# Altium schematic sheet io_connectors.SchDoc
size Letter; CompanyName: Carnegie Mellon University; Organization: Carnegie Mellon University; Address1: Carnegie Mellon University; Address2: Robotics Institute; Address3: 5000 Forbes Ave., 4208 NSH; Address4: Pittsburgh, PA 15213; DocumentNumber: 8; Revision: 1.0; SheetNumber: 8; SheetTotal: 8; PageSetup: Record=PageOptions|CenterHorizontal=True|CenterVertical=True|PrintScale=1.00|XCorrection=1.00|YCorrection=1.00|PrintKind=0|BorderSize=5000000|LeftOffset=0|BottomOffset=0|Orientation=2|PaperLength=1000|PaperWidth=1000|Scale=100|PaperSource=7|PrintQuality=-4|MediaType=1|DitherType=10|PaperKind=Letter|PrintScaleMode=1
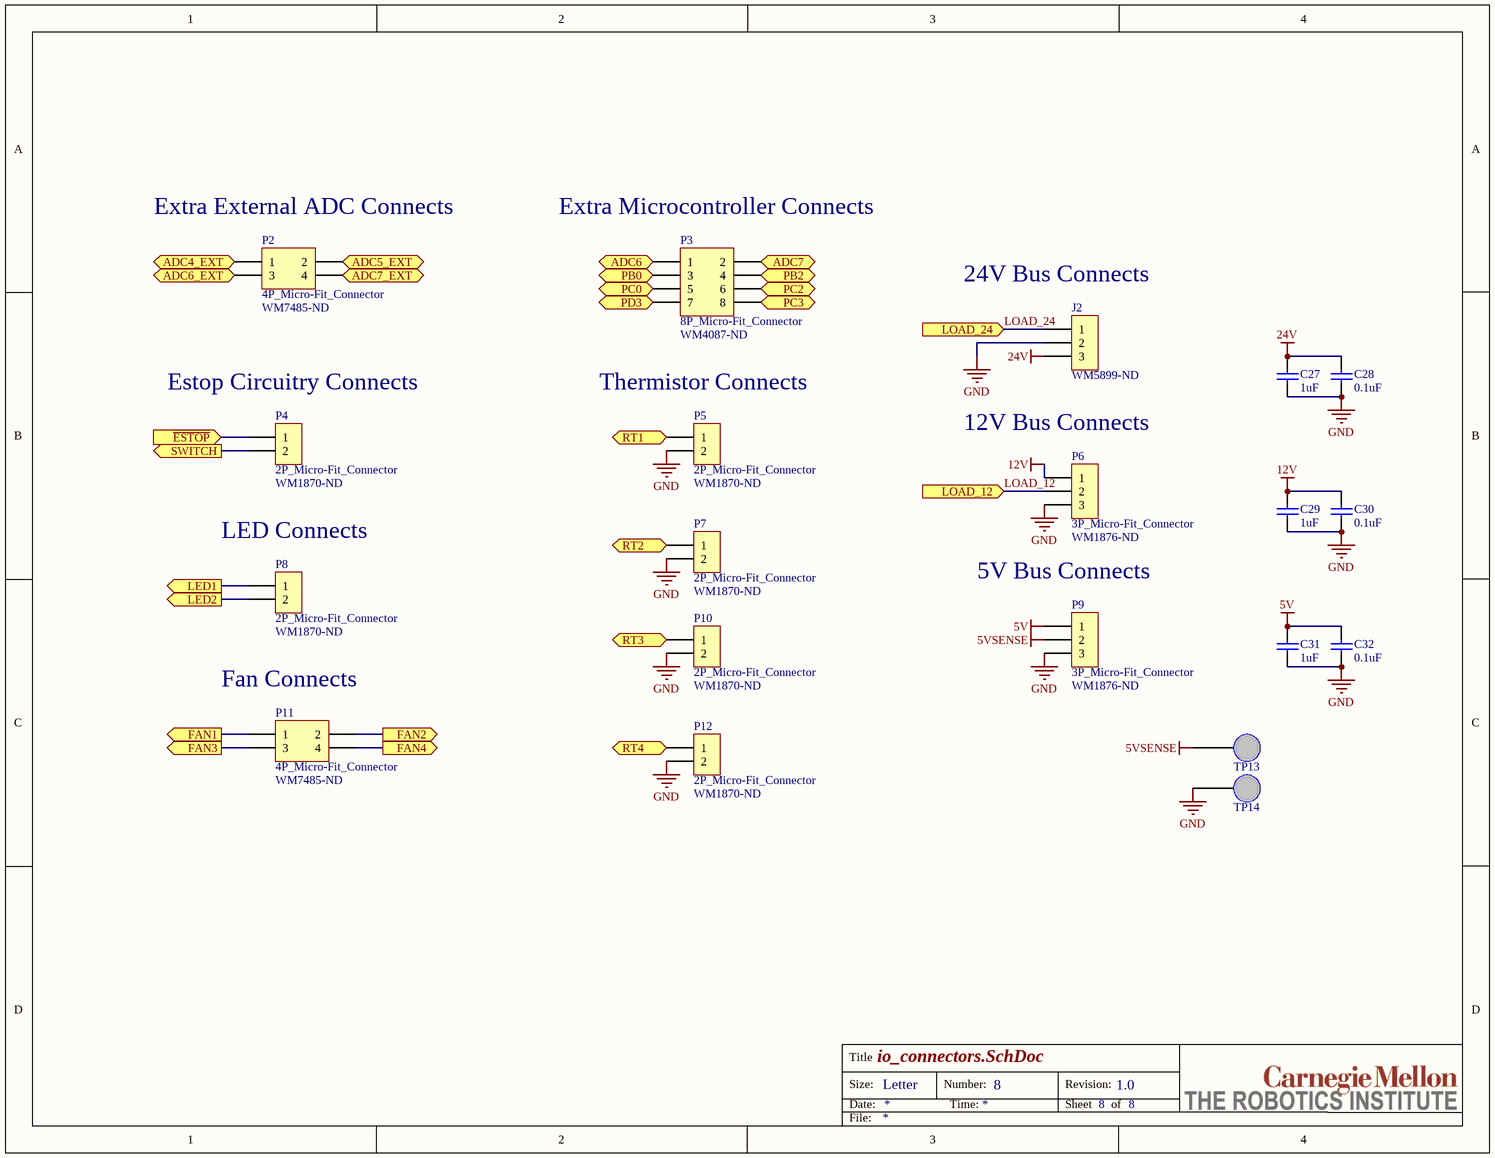
[diagram p0: io_connectors.SchDoc]

## Parts
C27  value 1uF  [CAPC1608N]  (hidden comment: Bypass, 24V, 1uF)
C28  value 0.1uF  [CAPC1608N]  (hidden comment: Bypass, 24V, 0.1uF)
C29  value 1uF  [CAPC1608N]  (hidden comment: Bypass, 12V, 1uF)
C30  value 0.1uF  [CAPC1608N]  (hidden comment: Bypass, 12V, 0.1uF)
C31  value 1uF  [CAPC1608N]  (hidden comment: Bypass, 5V, 1uF)
C32  value 0.1uF  [CAPC1608N]  (hidden comment: Bypass, 5V, 0.1uF)
J2  Supplier Part Number 1: WM5899-ND  [3P_Molex_Terminal_Block]  (hidden comment: Terminal Block)
P2  4P_Micro-Fit_Connector  Supplier Part Number 1: WM7485-ND  [4P_Micro-Fit_Header]
P3  8P_Micro-Fit_Connector  Supplier Part Number 1: WM4087-ND  [8P_Micro-Fit_Header]
P4  2P_Micro-Fit_Connector  Supplier Part Number 1: WM1870-ND  [2P_Micro-Fit_Header]
P5  2P_Micro-Fit_Connector  Supplier Part Number 1: WM1870-ND  [2P_Micro-Fit_Header]
P6  3P_Micro-Fit_Connector  Supplier Part Number 1: WM1876-ND  [3P_Micro-Fit_Header]
P7  2P_Micro-Fit_Connector  Supplier Part Number 1: WM1870-ND  [2P_Micro-Fit_Header]
P8  2P_Micro-Fit_Connector  Supplier Part Number 1: WM1870-ND  [2P_Micro-Fit_Header]
P9  3P_Micro-Fit_Connector  Supplier Part Number 1: WM1876-ND  [3P_Micro-Fit_Header]
P10  2P_Micro-Fit_Connector  Supplier Part Number 1: WM1870-ND  [2P_Micro-Fit_Header]
P11  4P_Micro-Fit_Connector  Supplier Part Number 1: WM7485-ND  [4P_Micro-Fit_Header]
P12  2P_Micro-Fit_Connector  Supplier Part Number 1: WM1870-ND  [2P_Micro-Fit_Header]
TP13  5V  [TestPoint]  (value not drawn)
TP14  GND  [TestPoint]  (value not drawn)

## Ports
ADC4_EXT (out), ADC5_EXT (out), ADC6 (out), ADC6_EXT (out), ADC7 (out), ADC7_EXT (out), FAN1 (out), FAN2 (out), FAN3 (out), FAN4 (out), LED1 (out), LED2 (out), LOAD_12 (in), LOAD_24 (in), PB0 (bidir), PB2 (bidir), PC0 (bidir), PC2 (bidir), PC3 (bidir), PD3 (bidir), RT1 (out), RT2 (out), RT3 (out), RT4 (out), SWITCH (out), ~{ESTOP} (in)

## Nets
5V: C31.2 C32.2 P9.1
5VSENSE: P9.2 TP13.1
12V: C29.2 C30.2 P6.1
24V: C27.2 C28.2 J2.3
GND: C27.1 C28.1 C29.1 C30.1 C31.1 C32.1 J2.2 P5.2 P6.3 P7.2 P9.3 P10.2 P12.2 TP14.1
ADC4_EXT: P2.1 ; port ADC4_EXT
ADC5_EXT: P2.2 ; port ADC5_EXT
ADC6: P3.1 ; port ADC6
ADC6_EXT: P2.3 ; port ADC6_EXT
ADC7: P3.2 ; port ADC7
ADC7_EXT: P2.4 ; port ADC7_EXT
~{ESTOP}: P4.1 ; port ~{ESTOP}
FAN1: P11.1 ; port FAN1
FAN2: P11.2 ; port FAN2
FAN3: P11.3 ; port FAN3
FAN4: P11.4 ; port FAN4
LED1: P8.1 ; port LED1
LED2: P8.2 ; port LED2
LOAD_12: P6.2 ; port LOAD_12
LOAD_24: J2.1 ; port LOAD_24
PB0: P3.3 ; port PB0
PB2: P3.4 ; port PB2
PC0: P3.5 ; port PC0
PC2: P3.6 ; port PC2
PC3: P3.8 ; port PC3
PD3: P3.7 ; port PD3
RT1: P5.1 ; port RT1
RT2: P7.1 ; port RT2
RT3: P10.1 ; port RT3
RT4: P12.1 ; port RT4
SWITCH: P4.2 ; port SWITCH

## Notes on the sheet
- (near P2) Extra External ADC Connects
- (near P3) Extra Microcontroller Connects
- (near J2) 24V Bus Connects
- (near P4) Estop Circuitry Connects
- (near P5) Thermistor Connects
- 12V Bus Connects
- (near P8) LED Connects
- 5V Bus Connects
- (near P11) Fan Connects
- Title
- Size:
- Date:
- Letter
- Number:
- Time:
- Revision:
- Sheet
- of
- File:

## Library data of the parts
C27 C29 C31 = Cap: Capacitor; Manufacturer: Murata Electronics North America; Manufacturer Part Number: GRM188R61H105KAALD; Description: CAP CER 1UF 50V X5R 0603; Capacitance: 1µF; Tolerance: ±10%; Voltage - Rated: 50V; Temperature Coefficient: X5R; Published: 8-Jun-2000; LatestRevisionDate: 17-Jul-2002; LatestRevisionNote: Re-released for DXP Platform.; PackageReference: RAD-0.3; Publisher: Altium Limited; PackageDescription: Radial Cap, Thru-Hole; 2 Leads; 0.3 in Pin Spacing; Supplier 1: Digi-Key; Supplier Part Number 1: 490-10732-1-ND; RoHS: RoHS Compliant; Category: Capacitors; Stock 1: 59223; Pricing 1: 1=0.17, 10=0.12, 50=0.069, 100=0.057, 250=0.048, 500=0.0402, 1000=0.033 (USD); Packaging: Cut Tape (CT); Mounting Type: Surface Mount, MLCC; Operating Temperature: -55°C ~ 85°C; Applications: General Purpose; Ratings: -; Package / Case: 0603 (1608 Metric); Size / Dimension: 0.063" L x 0.031" W (1.60mm x 0.80mm); Height - Seated (Max): -; Thickness (Max): 0.035" (0.90mm); Lead Spacing: -; Features: -; Lead Style: -; ComponentLink1URL: http://www.murata.com/~/media/webrenewal/support/library/catalog/products/capacitor/mlcc/c02e.pdf; ComponentLink1Description: http://www.murata.com/~/media/webrenewal/support/library/catalog/products/capacitor/mlcc/c02e.pdf
C28 C30 C32 = Cap: Capacitor; Manufacturer: Murata Electronics North America; Manufacturer Part Number: GRM188R71H104JA93D; Description: CAP CER 0.1UF 50V X7R 0603; Capacitance: 0.10µF; Tolerance: ±5%; Voltage - Rated: 50V; Temperature Coefficient: X7R; Published: 8-Jun-2000; LatestRevisionDate: 17-Jul-2002; LatestRevisionNote: Re-released for DXP Platform.; PackageReference: RAD-0.3; Publisher: Altium Limited; PackageDescription: Radial Cap, Thru-Hole; 2 Leads; 0.3 in Pin Spacing; Supplier 1: Digi-Key; Supplier Part Number 1: 490-13406-1-ND; RoHS: RoHS Compliant; Category: Capacitors; Stock 1: 7465; Pricing 1: 1=0.11, 10=0.078, 50=0.0422, 100=0.0358, 250=0.02924, 500=0.02502, 1000=0.0195 (USD); Packaging: Cut Tape (CT); Mounting Type: Surface Mount, MLCC; Operating Temperature: -55°C ~ 125°C; Applications: General Purpose; Ratings: -; Package / Case: 0603 (1608 Metric); Size / Dimension: 0.063" L x 0.031" W (1.60mm x 0.80mm); Height - Seated (Max): -; Thickness (Max): 0.031" (0.80mm); Lead Spacing: -; Features: -; Lead Style: -; ComponentLink1URL: http://www.murata.com/~/media/webrenewal/support/library/catalog/products/capacitor/mlcc/c02e.pdf; ComponentLink1Description: http://www.murata.com/~/media/webrenewal/support/library/catalog/products/capacitor/mlcc/c02e.pdf
J2 = 3P_Molex_Beau_38660: Screw Terminal Block; Supplier 1: Digi-Key
P2 P11 = 4P_Micro-Fit_Connector: 4 Pin Microfit Connector; LatestRevisionDate: 17-Jul-2002; LatestRevisionNote: Re-released for DXP Platform.; Publisher: Altium Limited; Supplier 1: Digi-Key
P3 = 8P_Micro-Fit_Connector: 8-Pin Microfit Connector; LatestRevisionDate: 17-Jul-2002; LatestRevisionNote: Re-released for DXP Platform.; Publisher: Altium Limited; Supplier 1: Digi-Key
P4 P5 P7 P8 P10 P12 = 2P_Micro-Fit_Connector: 2 Pin Microfit Connector; Manufacturer: Molex, LLC; Manufacturer Part Number: 0436500203; Connector Type: Header, Shrouded; Number of Positions: 2; Number of Positions Loaded: All; Pitch: 0.118" (3.00mm); Supplier 1: Digi-Key; RoHS: RoHS Compliant; Category: Connectors, Interconnects; Stock 1: 11989; Pricing 1: 1=0.99, 10=0.867, 50=0.7818, 100=0.7478, 250=0.6798, 500=0.61182, 1000=0.54384, 2500=0.49286, 5000=0.47586 (USD); Packaging: Tray; Contact Type: Male Pin; Number of Rows: 1; Row Spacing: -; Contact Mating Length: -; Mounting Type: Through Hole, Right Angle; Termination: Solder; Fastening Type: Locking Ramp; Features: Board Lock; Contact Finish: Tin; Contact Finish Thickness: 100µin (2.54µm); Color: Black; ComponentLink1URL: http://www.molex.com/pdm_docs/sd/436500203_sd.pdf; ComponentLink1Description: http://www.molex.com/pdm_docs/sd/436500203_sd.pdf
P6 P9 = 3P_Micro-Fit_Connector: 3 Pin Microfit Connector; Manufacturer: Molex, LLC; Manufacturer Part Number: 0436500304; Connector Type: Header, Shrouded; Number of Positions: 3; Number of Positions Loaded: All; Pitch: 0.118" (3.00mm); Supplier 1: Digi-Key; RoHS: RoHS Compliant; Category: Connectors, Interconnects; Stock 1: 19420; Pricing 1: 1=1.39, 25=1.152, 50=1.104, 100=1.056, 250=0.96, 500=0.864, 1000=0.768, 2500=0.696, 5000=0.672 (USD); Packaging: Tray; Contact Type: Male Pin; Number of Rows: 1; Row Spacing: -; Contact Mating Length: -; Mounting Type: Through Hole, Right Angle; Termination: Solder; Fastening Type: Locking Ramp; Features: Board Lock; Contact Finish: Gold; Contact Finish Thickness: 15µin (0.38µm); Color: Black; ComponentLink1URL: http://www.molex.com/pdm_docs/sd/436500304_sd.pdf; ComponentLink1Description: http://www.molex.com/pdm_docs/sd/436500304_sd.pdf
TP13 TP14 = Ring_Terminal: Test Point